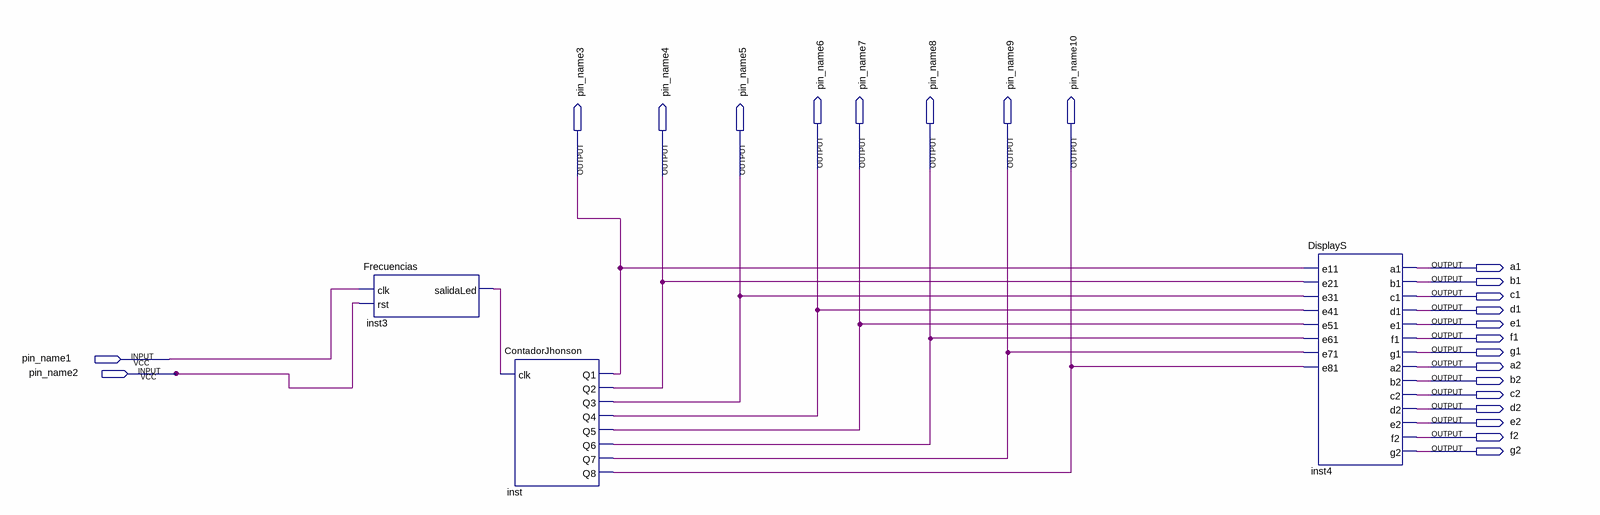
[diagram p0: schematic sheet]
// Quartus schematic practica5.bdf as structural Verilog: 3 symbols, 24 pins
module practica5 (
  input  pin_name1,
  input  pin_name2,
  output pin_name6,
  output pin_name7,
  output pin_name8,
  output pin_name9,
  output pin_name10,
  output pin_name3,
  output pin_name4,
  output pin_name5,
  output a1,
  output b1,
  output c1,
  output d1,
  output e1,
  output f1,
  output g1,
  output a2,
  output b2,
  output c2,
  output d2,
  output e2,
  output f2,
  output g2
);

  wire inst3_salidaled;

  Frecuencias inst3 (.clk(pin_name1), .rst(pin_name2), .salidaLed(inst3_salidaled));
  ContadorJhonson inst (
    .clk(inst3_salidaled), .Q1(pin_name3), .Q2(pin_name4), .Q3(pin_name5), .Q4(pin_name6), .Q5(pin_name7),
    .Q6(pin_name8), .Q7(pin_name9), .Q8(pin_name10));
  DisplayS inst4 (
    .e11(pin_name3), .e21(pin_name4), .e31(pin_name5), .e41(pin_name6), .e51(pin_name7), .e61(pin_name8),
    .e71(pin_name9), .e81(pin_name10), .a1(a1), .b1(b1), .c1(c1), .d1(d1), .e1(e1), .f1(f1), .g1(g1),
    .a2(a2), .b2(b2), .c2(c2), .d2(d2), .e2(e2), .f2(f2), .g2(g2));
endmodule
